# EAGLE schematic rpi_can (EAGLE 6.6.0)
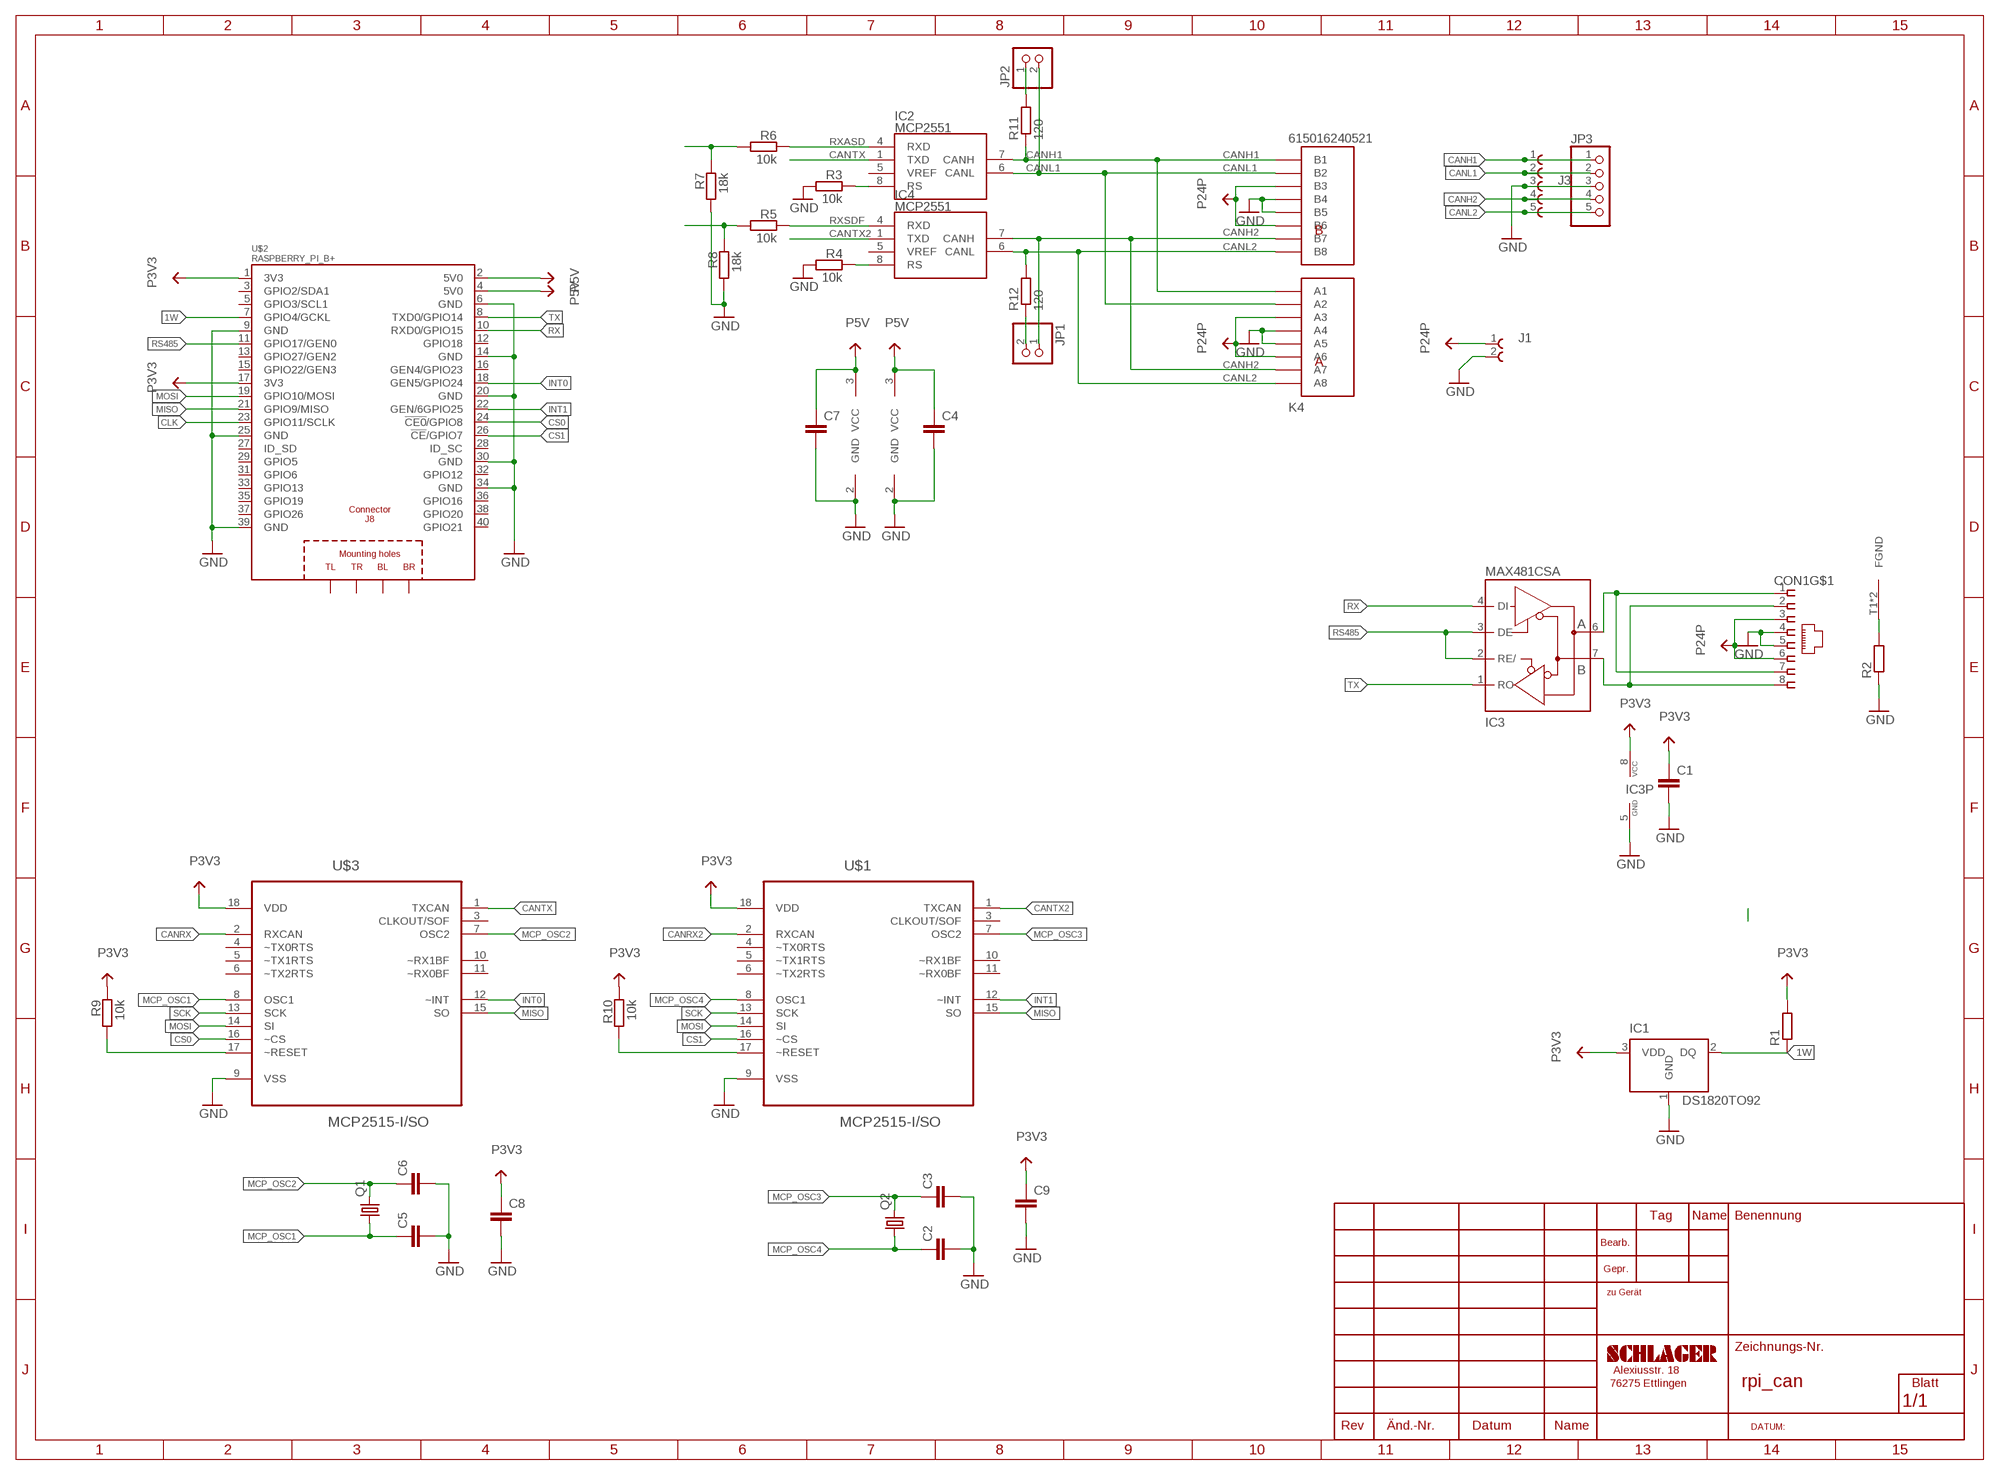
[diagram p0: schematic, sheet 1]

## Parts
C1  C-EUC0805  [C0805]
C2  C-EUC0805  [C0805]
C3  C-EUC0805  [C0805]
C4  C-EUC0805  [C0805]
C5  C-EUC0805  [C0805]
C6  C-EUC0805  [C0805]
C7  C-EUC0805  [C0805]
C8  C-EUC0805  [C0805]
C9  C-EUC0805  [C0805]
CON1  MEBP_8-8G  [MEBP]
IC1  DS1820TO92  [TO-92]
IC2  MCP2551  [SO-8]
IC3  MAX481CSA  [SO08]
IC4  MCP2551  [SO-8]
J1  691322310002  [691322310002]
J3  691322310005  [691322310005]
JP1  PINHD-1X2  [1X02]
JP2  PINHD-1X2  [1X02]
JP3  PINHD-1X5  [1X05]
K4  615016240521  [615016240521]
Q1  CRYSTALHC49S  [HC49/S]
Q2  CRYSTALHC49S  [HC49/S]
R1  R-EU_R0805  [R0805]
R2  R-EU_R0805  [R0805]
R3  10k  R-EU_R0805  [R0805]
R4  10k  R-EU_R0805  [R0805]
R5  10k  R-EU_R0805  [R0805]
R6  10k  R-EU_R0805  [R0805]
R7  18k  R-EU_R0805  [R0805]
R8  18k  R-EU_R0805  [R0805]
R9  10k  R-EU_R0805  [R0805]
R10  10k  R-EU_R0805  [R0805]
R11  120  R-EU_R0805  [R0805]
R12  120  R-EU_R0805  [R0805]
U$1  MCP2515-I/SO  [SOIC127P1034X264-18N]
U$2  RASPBERRY_PI_B+  [RASPBERRY_PI_B+]
U$3  MCP2515-I/SO  [SOIC127P1034X264-18N]

## Nets
1W: IC1.2(DQ) R1.1 U$2.7(GPIO4/GCKL)
CANH1: IC2.7(CANH) J3.1 JP3.1 K4.A1 K4.B1 R11.1
CANH2: IC4.7(CANH) J3.4 JP1.1 JP3.4 K4.A7 K4.B7
CANL1: IC2.6(CANL) J3.2 JP2.2 JP3.2 K4.A2 K4.B2
CANL2: IC4.6(CANL) J3.5 JP3.5 K4.A8 K4.B8 R12.2
CANRX: R6.2 R7.1 U$3.2(RXCAN)
CANRX2: R5.2 R8.1 U$1.2(RXCAN)
CANTX: IC2.1(TXD) U$3.1(TXCAN)
CANTX2: IC4.1(TXD) U$1.1(TXCAN)
CLK: U$2.23(GPIO11/SCLK)
CS0: U$2.24(!CE0!/GPIO8) U$3.16(~CS)
CS1: U$1.16(~CS) U$2.26(!CE!/GPIO7)
GND: C1.2 C2.2 C3.2 C4.2 C5.2 C6.2 C7.2 C8.2 C9.2 CON1.4 CON1.5 IC1.1(GND) IC2.2(GND) IC3.5(GND) IC4.2(GND) J1.2 J3.3 JP3.3 K4.A4 K4.A5 K4.B4 K4.B5 R2.1 R3.2 R4.2 R7.2 R8.2 U$1.9(VSS) U$2.6(GND) U$2.9(GND) U$2.14(GND) U$2.20(GND) U$2.25(GND) U$2.30(GND) U$2.34(GND) U$2.39(GND) U$3.9(VSS)
INT0: U$2.18(GEN5/GPIO24) U$3.12(~INT)
INT1: U$1.12(~INT) U$2.22(GEN/6GPIO25)
MCP_OSC1: C5.1 Q1.1 U$3.8(OSC1)
MCP_OSC2: C6.1 Q1.2 U$3.7(OSC2)
MCP_OSC3: C3.1 Q2.2 U$1.7(OSC2)
MCP_OSC4: C2.1 Q2.1 U$1.8(OSC1)
MISO: U$1.15(SO) U$2.21(GPIO9/MISO) U$3.15(SO)
MOSI: U$1.14(SI) U$2.19(GPIO10/MOSI) U$3.14(SI)
N$1: R10.2 U$1.17(~RESET)
N$2: IC2.8(RS) R3.1
N$3: CON1.T1(FGND) CON1.T2(FGND) R2.2
N$4: IC4.8(RS) R4.1
N$5: R9.2 U$3.17(~RESET)
N$6: JP2.1 R11.2
N$7: JP1.2 R12.1
P3V3: C1.1 C8.1 C9.1 IC1.3(VDD) IC3.8(VCC) R1.2 R9.1 R10.1 U$1.18(VDD) U$2.1(3V3) U$2.17(3V3) U$3.18(VDD)
P5V: C4.1 C7.1 IC2.3(VCC) IC4.3(VCC) U$2.2(5V0) U$2.4(5V0)
P24P: CON1.3 CON1.6 J1.1 K4.A3 K4.A6 K4.B3 K4.B6
RS485: IC3.2(RE/) IC3.3(DE) U$2.11(GPIO17/GEN0)
RS485_A: CON1.1 CON1.7 IC3.6(A)
RS485_B: CON1.2 CON1.8 IC3.7(B)
RX: IC3.4(DI) U$2.10(RXD0/GPIO15)
RXASD: IC2.4(RXD) R6.1
RXSDF: IC4.4(RXD) R5.1
SCK: U$1.13(SCK) U$3.13(SCK)
TX: IC3.1(RO) U$2.8(TXD0/GPIO14)
Unconnected: IC2.5(VREF) IC4.5(VREF) U$1.3(CLKOUT/SOF) U$1.4(~TX0RTS) U$1.5(~TX1RTS) U$1.6(~TX2RTS) U$1.10(~RX1BF) U$1.11(~RX0BF) U$2.3(GPIO2/SDA1) U$2.5(GPIO3/SCL1) U$2.12(GPIO18) U$2.13(GPIO27/GEN2) U$2.15(GPIO22/GEN3) U$2.16(GEN4/GPIO23) U$2.27(ID_SD) U$2.28(ID_SC) U$2.29(GPIO5) U$2.31(GPIO6) U$2.32(GPIO12) U$2.33(GPIO13) U$2.35(GPIO19) U$2.36(GPIO16) U$2.37(GPIO26) U$2.38(GPIO20) U$2.40(GPIO21) U$2.PE_BL(BL) U$2.PE_BR(BR) U$2.PE_TL(TL) U$2.PE_TR(TR) U$3.3(CLKOUT/SOF) U$3.4(~TX0RTS) U$3.5(~TX1RTS) U$3.6(~TX2RTS) U$3.10(~RX1BF) U$3.11(~RX0BF)

## Library data of the parts
C1-C9 = schlager_passiv:C-EU: CAPACITOR, European symbol
CON1 = myconn:MEBP_8-8G: Reichelt RJ45 geschirmt MEBP 8-8G
IC1 = schlager_ics:DS1820: DS1820 - 1-Wire Digital Thermometer
IC2 IC4 = MYMCHIP:MCP2551: CAN Transceiver
IC3 = maxim:MAX481CSA: RS485 TRANSEIVER; MF: MAXIM; MPN: MAX481CSA; OC_FARNELL: unknown; OC_NEWARK: 90C3817
J1 = Eagle_TERMINAL_BLOCKS_rev16a:691322310002: WR-TBL Serie 322 - 3.81mm Vertical PCB Header , 2 Pins=>Code : Con_TBL_Pluggable_3.81_PCB_THT_Simple_691322310002 <http://katalog.we-online.de/media/images/eican/Con_TBL_Pluggable_3.81_PCB_THT_Simple_6913223100xx_pf2.jpg> Details see: http://katalog.we-online.de/en/em/691_322_310_0xx Created 2014-06-19, Karrer Zheng 2014 (C) Würth Elektronik
J3 = Eagle_TERMINAL_BLOCKS_rev16a:691322310005: WR-TBL Serie 322 - 3.81mm Vertical PCB Header , 5 Pins=>Code : Con_TBL_Pluggable_3.81_PCB_THT_Simple_691322310005 <http://katalog.we-online.de/media/images/eican/Con_TBL_Pluggable_3.81_PCB_THT_Simple_6913223100xx_pf2.jpg> Details see: http://katalog.we-online.de/en/em/691_322_310_0xx Created 2014-06-19, Karrer Zheng 2014 (C) Würth Elektronik
JP1 JP2 = pinhead:PINHD-1X2: PIN HEADER
JP3 = pinhead:PINHD-1X5: PIN HEADER
K4 = Wuerth_Elektronik_eiCan_Communication_Connectors:615016240521: WR-MJ Horizontal Shielded Dual Stacked Port with EMI Panel Finger 8P8C Modular Jack Tab Up & Down, 16 Pins
Q1 Q2 = crystal:CRYSTAL: CRYSTAL; OC_FARNELL: 1667008; OC_NEWARK: unknown
R1-R12 = schlager_passiv:R-EU_: RESISTOR, European symbol
U$1 U$3 = schlager_ics:MCP2515-I/SO: CAN Controller; MPN: MCP2515-I/SO; OC_FARNELL: 1292239; OC_NEWARK: 29H7136; PACKAGE: SOIC-18; SUPPLIER: Microchip
U$2 = schlager_modules:RASPBERRY_PI_B+

## Net classes
4 USBpair: width 0.254 mm, drill 0.406 mm, clearance 0.508 mm